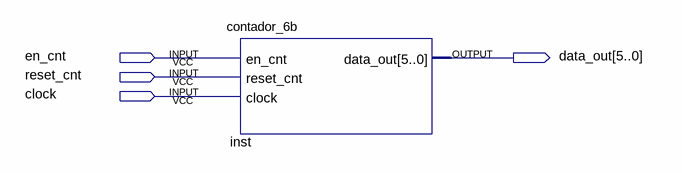
[diagram p0: schematic sheet]
// Quartus schematic contador_prueba.bdf as structural Verilog: 1 symbols, 4 pins
module contador_prueba (
  input  en_cnt,
  input  reset_cnt,
  input  clock,
  output [5:0] data_out
);

  contador_6b inst (.en_cnt(en_cnt), .reset_cnt(reset_cnt), .clock(clock), .data_out(data_out));
endmodule
